# EAGLE design das_updated_v7 (EAGLE 9.6.2)
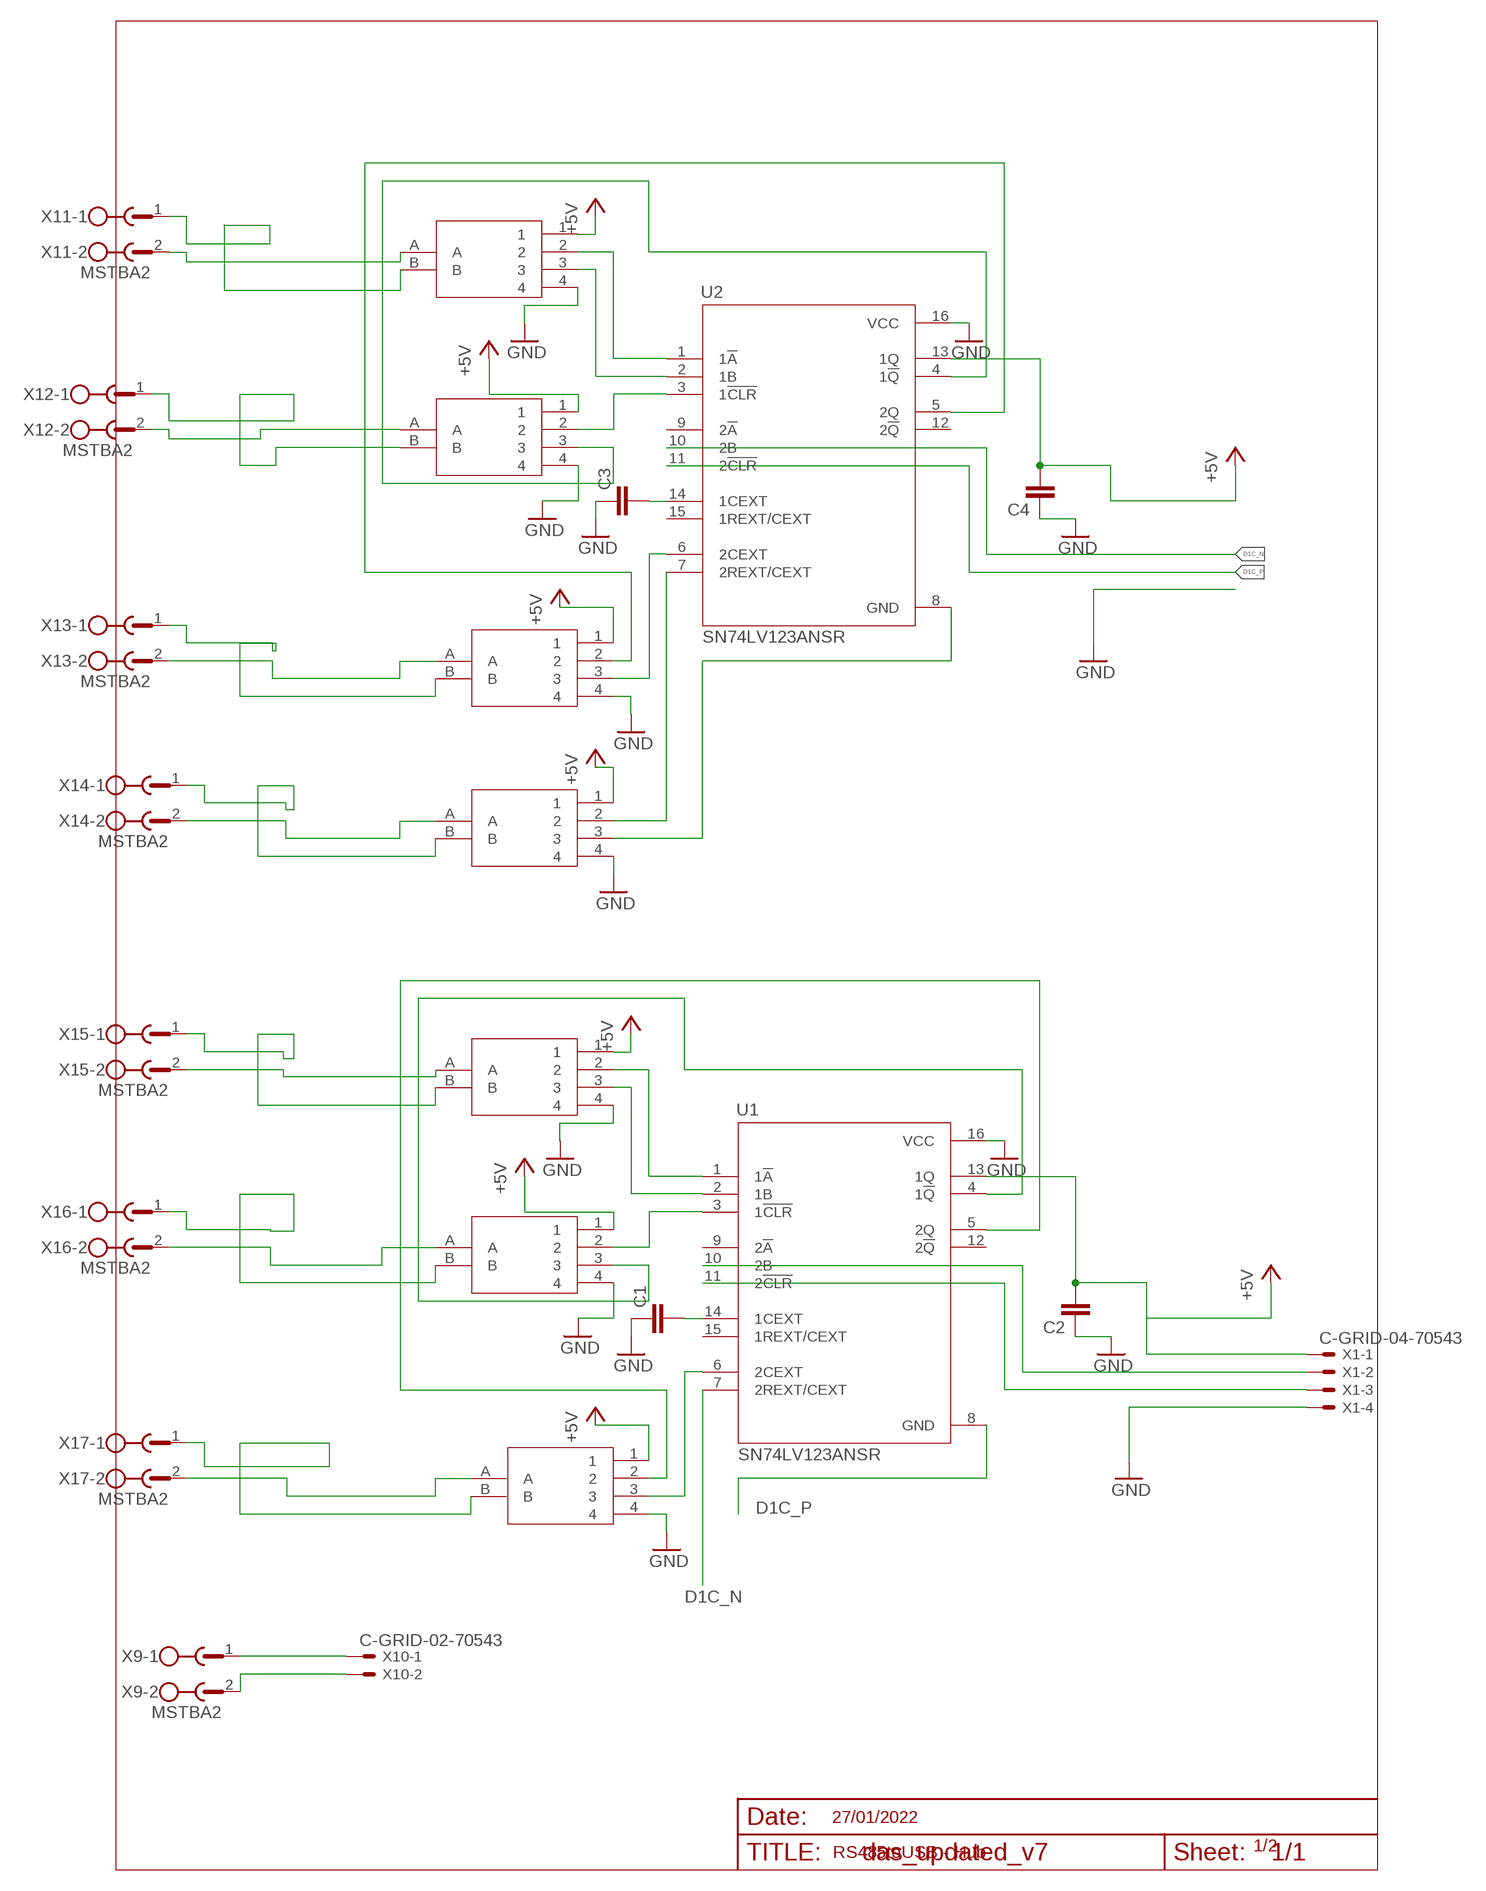
[diagram p0: schematic, sheet 1]

## Parts
C1  C-EUC0603K  [C0603K]
C2  C-EUC0603K  [C0603K]
C3  C-EUC0603K  [C0603K]
C4  C-EUC0603K  [C0603K]
U1  SN74LV123ANSR  [SOIC127P780X200-16N]
U2  SN74LV123ANSR  [SOIC127P780X200-16N]
USB2RS1  USB2RS485  [USB2RS485]
USB2RS2  USB2RS485  [USB2RS485]
USB2RS3  USB2RS485  [USB2RS485]
USB2RS5  USB2RS485  [USB2RS485]
USB2RS6  USB2RS485  [USB2RS485]
USB2RS7  USB2RS485  [USB2RS485]
USB2RS8  USB2RS485  [USB2RS485]
X1  C-GRID-04-70543  [70543-04]
X9  MSTBA2  [MSTBA2]
X10  C-GRID-02-70543  [70543-02]
X11  MSTBA2  [MSTBA2]
X12  MSTBA2  [MSTBA2]
X13  MSTBA2  [MSTBA2]
X14  MSTBA2  [MSTBA2]
X15  MSTBA2  [MSTBA2]
X16  MSTBA2  [MSTBA2]
X17  MSTBA2  [MSTBA2]

## Nets
+5V: C2.2 C4.2 U1.13(1Q) U2.13(1Q) USB2RS1.1 USB2RS2.1 USB2RS3.1 USB2RS5.1 USB2RS6.1 USB2RS7.1 USB2RS8.1 X1.1
D1C_N [data]: U1.7(2REXT/CEXT) U2.10(2B)
D1C_P [data]: U1.8(GND) U2.11(2!CLR)
D2+ [data]: U2.8(GND) USB2RS8.3
D2- [data]: U2.7(2REXT/CEXT) USB2RS8.2
D_N [data]: U1.11(2!CLR) X1.3
D_P [data]: U1.10(2B) X1.2
GND: C1.1 C2.1 C3.1 C4.1 U1.16(VCC) U2.16(VCC) USB2RS1.4 USB2RS2.4 USB2RS3.4 USB2RS5.4 USB2RS6.4 USB2RS7.4 USB2RS8.4 X1.4
MOD2_N [data]: U1.6(2CEXT) USB2RS3.3
MOD2_P [data]: U1.5(2Q) USB2RS3.2
MOD3_N [data]: U1.4(1!Q) USB2RS2.3
MOD3_P [data]: U1.3(1!CLR) USB2RS2.2
MOD4_N [data]: U1.2(1B) USB2RS1.3
MOD4_P [data]: U1.1(1!A) USB2RS1.2
MOD7_N [data]: U2.6(2CEXT) USB2RS7.3
MOD7_P [data]: U2.5(2Q) USB2RS7.2
MOD8_N [data]: U2.4(1!Q) USB2RS6.3
MOD8_P [data]: U2.3(1!CLR) USB2RS6.2
MOD9_N [data]: U2.2(1B) USB2RS5.3
MOD9_P [data]: U2.1(1!A) USB2RS5.2
N$3: X9.1 X10.1
N$4: X9.2 X10.2
N$7: C1.2 U1.14(1CEXT)
N$17: C3.2 U2.14(1CEXT)
X2_N [data]: USB2RS3.B X17.1
X2_P [data]: USB2RS3.A X17.2
X3_N [data]: USB2RS2.B X16.1
X3_P [data]: USB2RS2.A X16.2
X4_N [data]: USB2RS1.B X15.1
X4_P [data]: USB2RS1.A X15.2
X5_N [data]: USB2RS8.B X14.1
X5_P [data]: USB2RS8.A X14.2
X6_N [data]: USB2RS7.B X13.1
X6_P [data]: USB2RS7.A X13.2
X7_N [data]: USB2RS6.B X12.1
X7_P [data]: USB2RS6.A X12.2
X8_N [data]: USB2RS5.B X11.1
X8_P [data]: USB2RS5.A X11.2
Unconnected: U1.9(2!A) U1.12(2!Q) U1.15(1REXT/CEXT) U2.9(2!A) U2.12(2!Q) U2.15(1REXT/CEXT)

## Notes on the sheet
- 27/01/2022
- 1/2
- RS485toUSB - Hub

## Library data of the parts
C1-C4 = resistor:C-EU: CAPACITOR, European symbol
U1 U2 = SN74LV123ANSR:SN74LV123ANSR: Monostable Multivibrator 13ns 16-SO Check prices <https://pricing.snapeda.com/parts/SN74LV123ANSR/Texas%20Instruments/view-part?ref=eda>; AVAILABILITY: In Stock; DESCRIPTION: Dual Retriggerable Monostable Multivibrators 16-SO -40 to 125; MF: Texas Instruments; MP: SN74LV123ANSR; PACKAGE: SOP-16 Texas Instruments; PRICE: None; PURCHASE-URL: https://pricing.snapeda.com/search/part/SN74LV123ANSR/?ref=eda
USB2RS1-USB2RS3 USB2RS5-USB2RS8 = USB2RS485:USB2RS485
X1 = con-molex:C-GRID-04: CONNECTOR wire to board 2.54 mm (0.100") pitch header; MF: MOLEX; OC_FARNELL: unknown; OC_NEWARK: unknown
X9 X11-X17 = con-phoenix-508:MSTBA2: PHOENIX; MF: FARNELL; MPN: 1757242; OC_FARNELL: 3705171; OC_NEWARK: 71C4161
X10 = con-molex:C-GRID-02: CONNECTOR wire to board 2.54 mm (0.100") pitch header; MF: MOLEX; OC_FARNELL: unknown; OC_NEWARK: unknown

## Net classes
0 default: clearance 0.305 mm
1 data: width 0.127 mm, clearance 0.305 mm

## Board
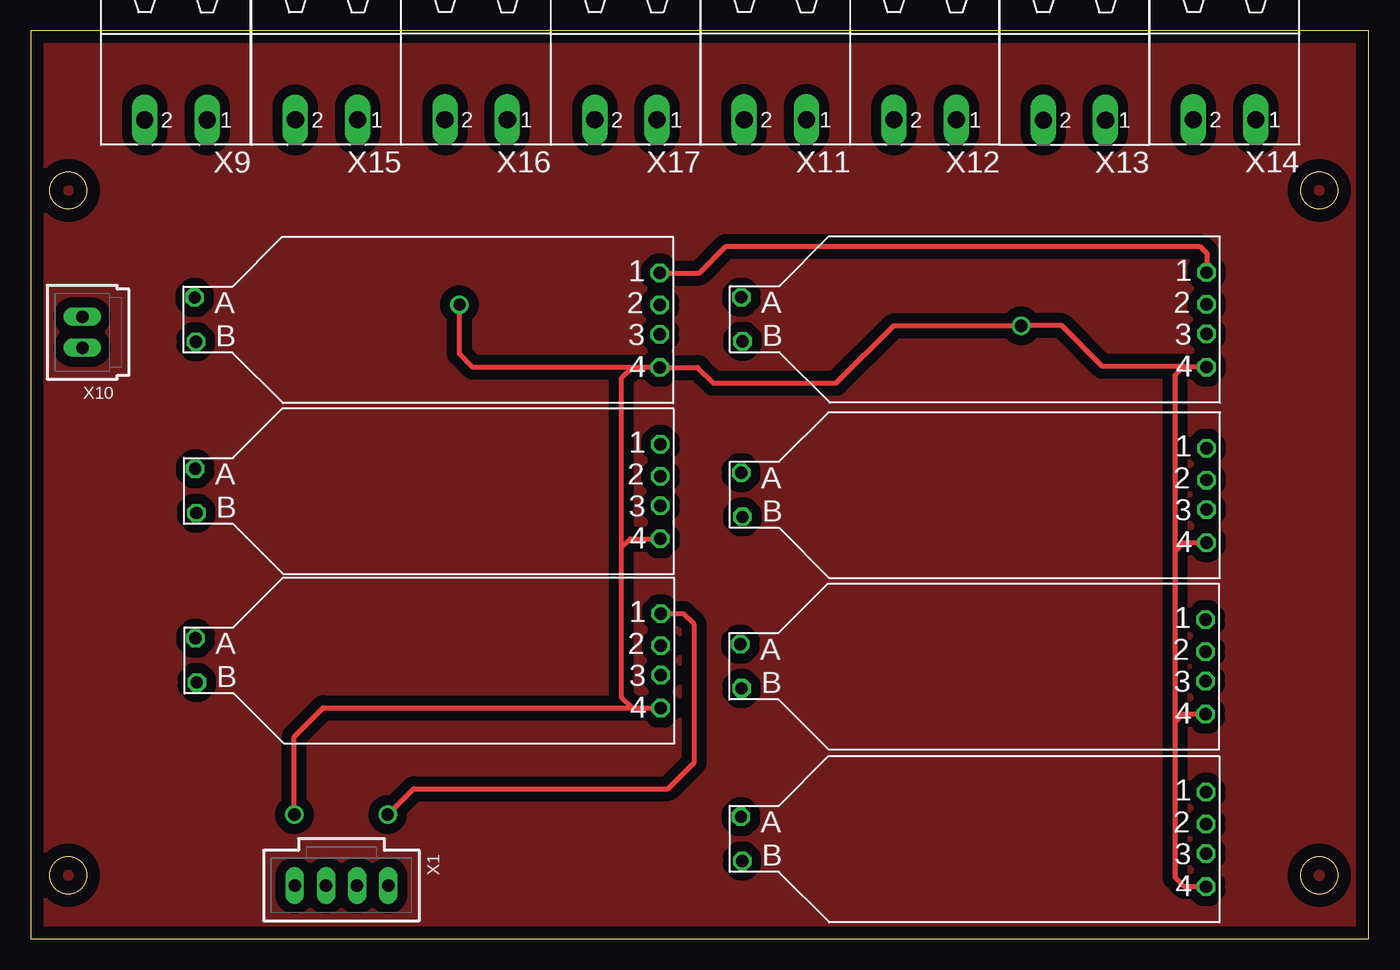
[diagram p1: board, top side]
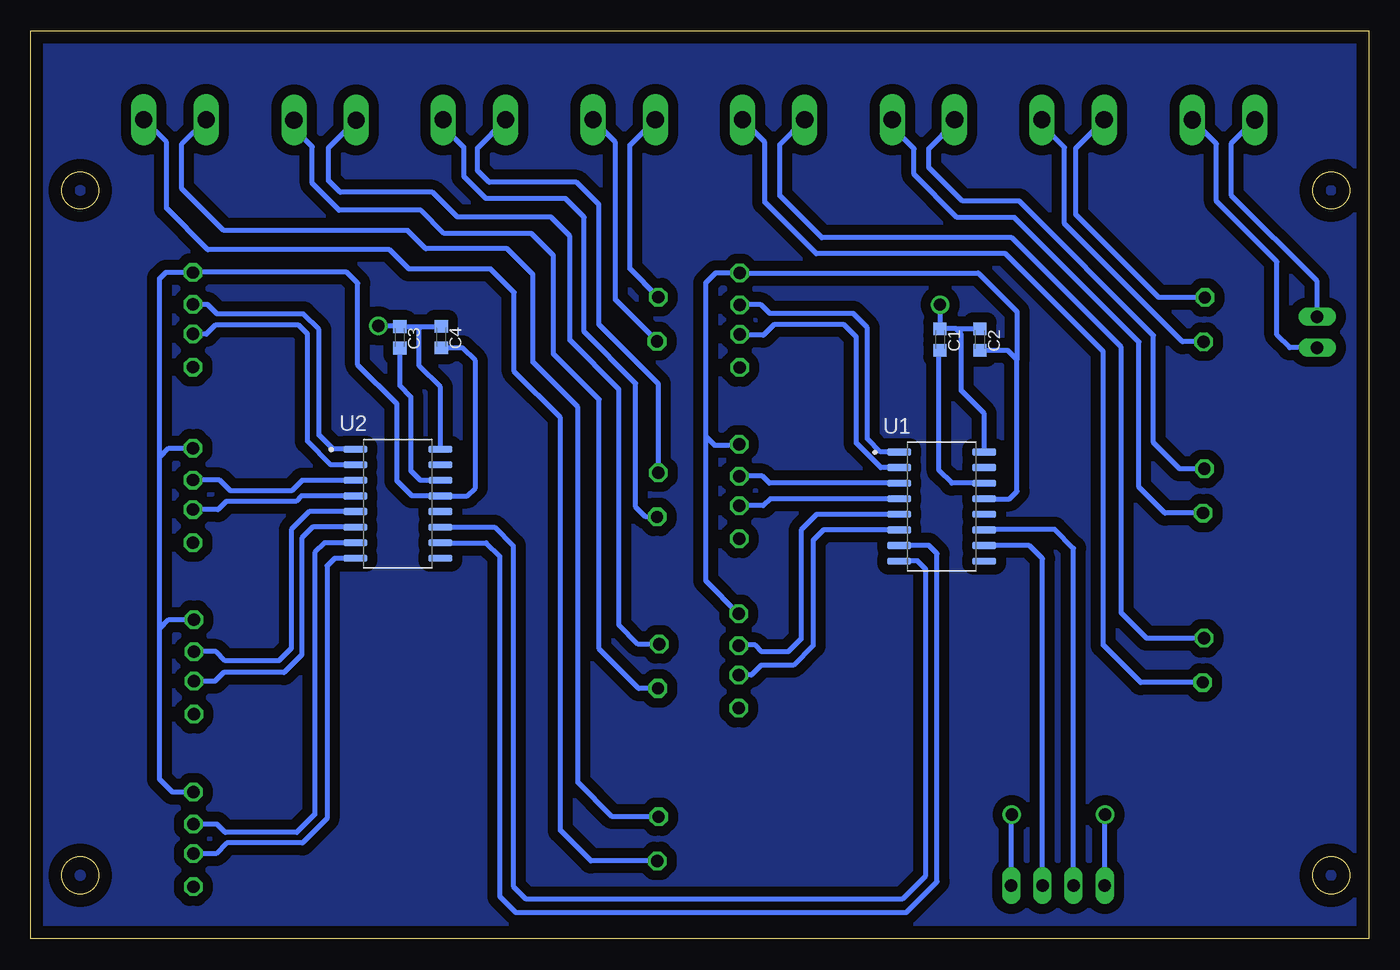
[diagram p2: board, bottom side, seen from below]

Size 109 x 74 mm. Coordinates in mm from the lower left corner, seen from the top.
Outline: 0,0 109,0 109,74 0,74 0,0
Outline: circle at 3.07,60.98 radius 1.5
Outline: circle at 3.07,5.2 radius 1.5
Outline: circle at 104.97,5.2 radius 1.5
Outline: circle at 104.97,60.98 radius 1.5
Copper layers (1*16): Top 0.035mm / dielectric 1.5mm / Bottom 0.035mm
Design rules "default": minimum track width 6mil, minimum drill 0.35mm, track to track 6mil, track to pad 6mil, pad to pad 6mil, via to via 6mil, smd to smd 6mil, copper to edge 40mil, drill to drill 6mil, minimum pad ring 10mil, minimum via ring 8mil, stop-mask expansion 4mil, vias tented up to drill 0mil, thermal gap 10mil

### Footprints (pad centres in the part's own frame; a part is rotated, then mirrored left to right if it is on the bottom)
C0603K = smd 1.05 x 1.08: 1 -0.875,0; 2 0.875,0
SOIC127P780X200-16N = smd 1.97 x 0.61: 1 -3.465,4.445; 2 -3.465,3.175; 3 -3.465,1.905; 4 -3.465,0.635; 5 -3.465,-0.635; 6 -3.465,-1.905; 7 -3.465,-3.175; 8 -3.465,-4.445; 9 3.465,-4.445; 10 3.465,-3.175; 11 3.465,-1.905; 12 3.465,-0.635; 13 3.465,0.635; 14 3.465,1.905; 15 3.465,3.175; 16 3.465,4.445
USB2RS485 = drill 1 pad 1.422 octagon: 1 36.9,3.6; 2 36.9,1; 3 36.9,-1.4; 4 36.9,-4.1; A -1,1.6; B -0.9,-2
70543-04 = drill 1.016 long: 1 -3.81,0; 2 -1.27,0; 3 1.27,0; 4 3.81,0
MSTBA2 = drill 1.397 long: 1 -2.54,5.08; 2 2.54,5.08
70543-02 = drill 1.016 long: 1 -1.27,0; 2 1.27,0

### Placement (x,y rotation side)
C1  34.93,48.84 270 bottom
C2  31.68,48.83 270 bottom
C3  78.93,49.01 270 bottom
C4  75.54,49.03 270 bottom
U1  34.79,35.23 0 bottom
U2  79.08,35.46 0 bottom
USB2RS1  14.35,50.66 0 top
USB2RS2  14.39,36.7 0 top
USB2RS3  14.43,22.9 0 top
USB2RS5  58.88,50.69 0 top
USB2RS6  58.87,36.39 0 top
USB2RS7  58.8,22.42 0 top
USB2RS8  58.85,8.36 0 top
X1  25.32,4.35 180 top
X9  11.83,71.81 180 top
X10  4.2,49.43 90 top
X11  60.66,71.83 180 top
X12  72.85,71.82 180 top
X13  85.02,71.8 180 top
X14  97.25,71.84 180 top
X15  24.1,71.82 180 top
X16  36.28,71.83 180 top
X17  48.49,71.82 180 top

### Tracks (layer width: path | path; a pad name or v marks a point on that pad's centre or on a via)
+5V  (via drill 1)
  Top 0.406: USB2RS1.1 54.47,54.26 56.64,56.43 95.23,56.43 95.79,55.88 95.79,54.31 USB2RS5.1 | v29.08,10.13 31.19,12.25 51.91,12.25 54.06,14.4 54.06,25.62 53.18,26.5 USB2RS3.1
  Bottom 0.406: USB2RS8.1 97.44,11.96 98.5,13.02 98.5,25.27 | USB2RS7.1 97.75,26.02 98.5,25.27 | 98.5,25.27 98.5,39.24 | 98.5,39.24 97.74,39.99 USB2RS6.1 | 98.5,39.24 98.5,53.81 97.98,54.33 95.81,54.33 | 95.81,54.33 USB2RS5.1 | 95.81,54.33 83.24,54.33 82.35,53.44 82.35,46.78 79.17,43.59 79.17,37.31 77.95,36.09 U2.13 73.44,36.09 72.77,36.76 72.77,47.11 73.83,48.16 C4.2 | 54.03,40.96 54.03,53.44 53.21,54.26 USB2RS1.1 31.81,54.26 28.66,51.11 28.66,47.21 | 54.03,40.96 53.3,40.23 51.37,40.23 USB2RS2.1 | 54.03,40.96 54.03,29.21 USB2RS3.1 | U1.13 29.27,35.87 28.66,36.47 28.66,47.21 | C2.2 29.41,47.96 28.66,47.21 | X1.1 29.13,10.08 v29.08,10.13
D1C_N
  Bottom 0.406: U2.10 71.9,32.28 70.81,31.19 70.81,3.48 69.5,2.17 37.68,2.17 35.17,4.68 35.17,31.4 35.84,32.07 38.24,32.07 U1.7
D1C_P
  Bottom 0.406: U2.11 71.23,33.55 69.7,32.02 69.7,4.3 68.69,3.29 37.96,3.29 36.09,5.17 36.09,30.12 36.77,30.8 38.24,30.8 U1.8
D2+
  Bottom 0.406: U2.8 84.24,31.01 84.86,30.4 84.86,9.83 86.85,7.84 93.03,7.84 93.91,6.96 USB2RS8.3
D2-
  Bottom 0.406: U2.7 85.06,32.28 85.86,31.49 85.86,10.15 87.32,8.69 93.15,8.69 93.82,9.36 USB2RS8.2
D_N
  Bottom 0.406: X1.3 24.05,31.83 25.59,33.37 31.28,33.37 U1.11
D_P
  Bottom 0.406: X1.2 26.59,30.99 27.65,32.05 U1.10
GND  (via drill 1)
  Top 0.406: USB2RS8.4 93.98,4.26 93.22,5.01 93.22,17.65 | 93.22,17.65 93.91,18.33 95.69,18.33 USB2RS7.4 | 93.22,17.65 93.22,31.6 | USB2RS6.4 93.91,32.29 93.22,31.6 | 93.22,31.6 93.22,45.96 93.91,46.65 | 93.91,46.65 95.73,46.65 USB2RS5.4 | 93.91,46.65 87.3,46.65 83.99,49.96 v80.68,49.96 70.3,49.96 65.61,45.27 55.61,45.27 54.33,46.56 USB2RS1.4 48.96,46.56 | USB2RS3.4 49,18.8 48.97,18.83 | 48.97,18.83 48.14,19.66 48.14,31.92 | 48.14,31.92 48.83,32.61 USB2RS2.4 | 48.14,31.92 48.14,45.74 48.96,46.56 | 48.96,46.56 36.04,46.56 34.92,47.68 34.92,51.66 v34.94,51.67 v34.93,51.68 | v21.48,10.15 21.48,16.48 23.83,18.83 48.97,18.83
  Bottom 0.406: 77.21,49.88 C3.1 79.01,49.96 v80.68,49.96 | 77.21,49.88 75.57,49.88 C4.1 | U2.16 75.62,44.96 77.34,46.69 77.34,49.75 77.21,49.88 | U1.16 31.32,42.81 33.2,44.68 33.2,49.28 33.66,49.74 | 33.66,49.74 34.83,49.74 | 34.83,49.74 34.9,49.74 C1.1 | 33.66,49.74 31.71,49.74 C2.1 | v34.93,51.68 34.93,49.84 34.83,49.74 | X1.4 21.51,10.05 21.54,10.08 v21.48,10.15
MOD2_N
  Bottom 0.406: U1.6 44.42,33.33 45.27,32.47 45.27,23.9 46.88,22.29 49.5,22.29 50.29,21.5 USB2RS3.3
MOD2_P
  Bottom 0.406: U1.5 44.98,34.59 46.26,33.32 46.26,24.44 47.3,23.4 49.44,23.4 49.97,23.94 51.29,23.94 USB2RS3.2
MOD3_N
  Bottom 0.406: U1.4 48.75,35.87 49.31,35.3 USB2RS2.3
MOD3_P
  Bottom 0.406: U1.3 48.84,37.13 49.41,37.7 USB2RS2.2
MOD4_N
  Bottom 0.406: U1.2 39.76,38.41 41.74,40.39 41.74,49.04 42.75,50.05 48.46,50.05 49.31,49.2 51.19,49.2 USB2RS1.3
MOD4_P
  Bottom 0.406: U1.1 39.76,39.67 40.85,40.77 40.85,49.81 41.99,50.95 48.8,50.95 49.51,51.67 USB2RS1.2
MOD7_N
  Bottom 0.406: U2.6 86.04,33.55 86.93,32.67 86.93,23.15 88.36,21.71 93.29,21.71 94,21 95.69,21 USB2RS7.3
MOD7_P
  Bottom 0.406: U2.5 86.31,34.82 87.78,33.35 87.78,23.67 88.8,22.66 93.15,22.66 93.91,23.42 USB2RS7.2
MOD8_N
  Bottom 0.406: U2.4 86.95,36.09 87.4,35.65 93.07,35.65 93.73,34.99 USB2RS6.3
MOD8_P
  Bottom 0.406: U2.3 86.9,37.36 87.76,36.5 92.72,36.5 93.61,37.39 USB2RS6.2
MOD9_N
  Bottom 0.406: U2.2 84.53,38.63 86.45,40.56 86.45,49.3 87.15,50 93.96,50 94.69,49.27 95.75,49.27 USB2RS5.3
MOD9_P
  Bottom 0.406: U2.1 84.38,39.9 85.52,41.04 85.52,49.64 86.8,50.93 93.83,50.93 94.59,51.69 USB2RS5.2
N$1
  pour Top (isolate 0.813): 0,74 109,74 109,0 0,0
N$2
  pour Bottom (isolate 0.813): 0,74 109,74 109,0 0,0
N$3
  Bottom 0.406: X10.1 6.45,48.16 7.49,49.2 7.49,55.18 12.42,60.11 12.42,64.78 X9.1
N$4
  Bottom 0.406: X10.2 4.2,53.59 11.2,60.58 11.2,64.83 X9.2
N$7
  Bottom 0.406: U1.14 33.98,37.13 35,38.16 35,47.89 C1.2
N$17
  Bottom 0.406: U2.14 77.26,37.36 78.03,38.13 78.03,44.17 78.93,45.07 C3.2
X2_N
  Bottom 0.406: USB2RS3.B 18.59,20.9 21.64,23.95 21.64,47.87 29.6,55.83 45,55.83 49.19,60.02 49.19,64.9 X17.1
X2_P
  Bottom 0.406: USB2RS3.A 18.08,24.5 20.16,26.58 20.16,48.21 29.08,57.13 44.55,57.13 47.97,60.55 47.97,64.72 X17.2
X3_N
  Bottom 0.406: USB2RS2.B 16.61,34.7 18.72,36.81 18.72,48.63 28.87,58.78 33.53,58.78 37.05,62.3 37.05,64.38 38.82,66.15 X16.1
X3_P
  Bottom 0.406: USB2RS2.A 15.4,38.3 17.53,40.43 17.53,49.17 28.48,60.12 33.1,60.12 35.84,62.86 35.84,64.4 33.74,66.5 X16.2
X4_N
  Bottom 0.406: USB2RS1.B 15.19,48.66 24.79,58.26 24.79,64.48 26.64,66.32 X15.1
X4_P
  Bottom 0.406: USB2RS1.A 17.12,52.26 23.88,59.02 23.88,64.42 X15.2
X5_N
  Bottom 0.406: USB2RS8.B 63.37,6.36 65.86,8.84 65.86,42.48 69.62,46.25 69.62,52.67 71.53,54.58 78.19,54.58 79.78,56.16 94.56,56.16 97.94,59.54 97.94,64.91 X14.1
X5_P
  Bottom 0.406: USB2RS8.A 61.63,9.96 64.42,12.75 64.42,43.34 68.08,46.99 68.08,54.13 70.19,56.24 76.83,56.24 78.3,57.71 93.28,57.71 96.68,61.12 96.68,64.78 X14.2
X6_N
  Bottom 0.406: USB2RS7.B 59.47,20.42 62.7,23.65 62.7,43.96 66.41,47.67 66.41,55.69 68.2,57.48 75.32,57.48 77.21,59.37 83.88,59.37 86.07,61.56 86.07,64.54 87.56,66.02 X13.1
X6_P
  Bottom 0.406: USB2RS7.A 59.51,24.02 61.08,25.59 61.08,44.78 65.08,48.78 65.08,57.26 66.63,58.81 74.24,58.81 76.27,60.83 83.79,60.83 84.74,61.78 84.74,64.46 X13.2
X7_N
  Bottom 0.406: USB2RS6.B 58.9,34.39 59.72,35.2 59.72,45.26 63.92,49.47 63.92,58.8 65.44,60.32 71.91,60.32 73.7,62.11 73.7,64.47 75.39,66.17 X12.1
X7_P
  Bottom 0.406: USB2RS6.A 57.88,45.22 62.72,50.07 62.72,59.84 64.55,61.66 71.65,61.66 72.61,62.61 72.61,64.44 X12.2
X8_N
  Bottom 0.406: USB2RS5.B 61.36,52.08 61.36,64.91 X11.1
X8_P
  Bottom 0.406: USB2RS5.A 60.19,54.6 60.19,64.68 X11.2